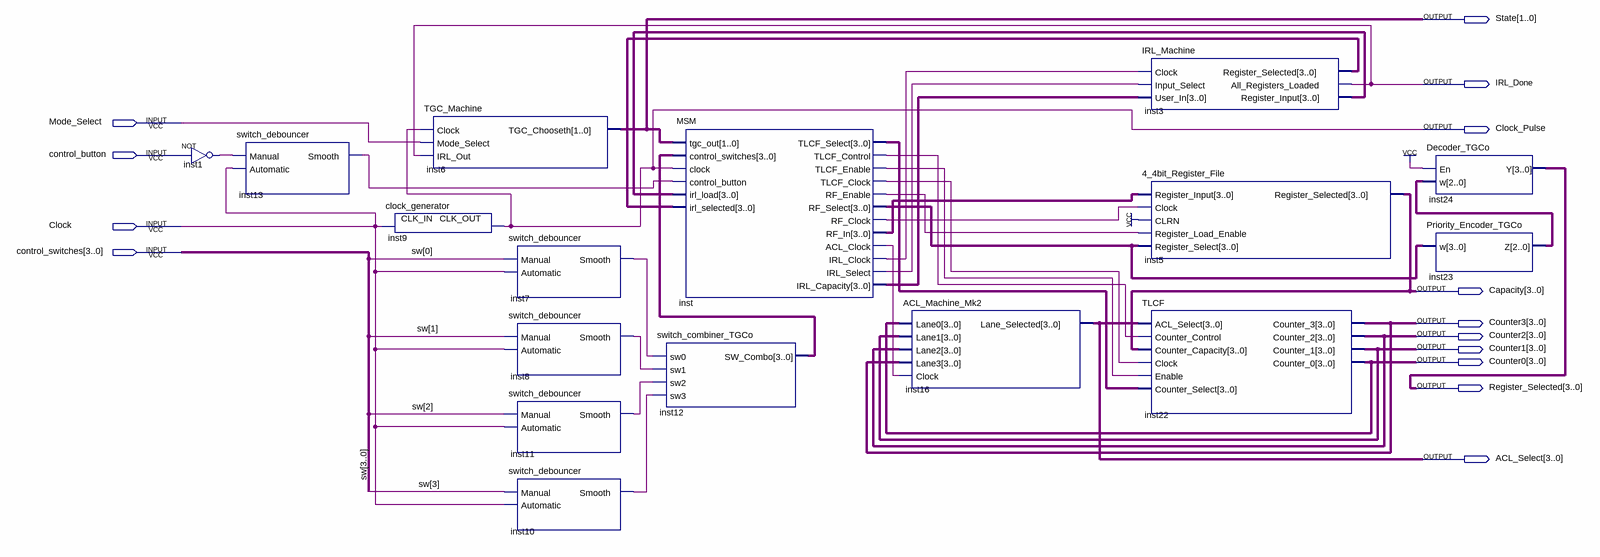
[diagram p0: schematic sheet]
// Quartus schematic TGCo.bdf as structural Verilog: 16 symbols, 14 pins
module TGCo (
  input  Mode_Select,
  input  control_button,
  input  Clock,
  input  [3:0] control_switches,
  output [1:0] State,
  output IRL_Done,
  output Clock_Pulse,
  output [3:0] Capacity,
  output [3:0] Counter3,
  output [3:0] Counter2,
  output [3:0] Counter1,
  output [3:0] Counter0,
  output [3:0] Register_Selected,
  output [3:0] ACL_Select
);

  wire inst1_out, inst7_smooth, inst8_smooth, inst10_smooth, inst11_smooth, inst13_smooth, inst_acl_clock,
       inst_irl_clock, inst_irl_select, inst_rf_clock, inst_rf_enable, inst_tlcf_clock, inst_tlcf_control,
       inst_tlcf_enable;
  wire [2:0] inst23_z;
  wire [3:0] inst3_register_input, inst3_register_selected, inst12_sw_combo, inst_irl_capacity, inst_rf_in,
       inst_rf_select, inst_tlcf_select;

  not inst1 (inst1_out, control_button);
  switch_debouncer inst13 (.Manual(inst1_out), .Automatic(Clock), .Smooth(inst13_smooth));
  TGC_Machine inst6 (.Clock(Clock_Pulse), .Mode_Select(Mode_Select), .IRL_Out(IRL_Done), .TGC_Chooseth(State));
  clock_generator inst9 (.CLK_IN(Clock), .CLK_OUT(Clock_Pulse));
  switch_debouncer inst7 (.Manual(control_switches[0]), .Automatic(Clock), .Smooth(inst7_smooth));
  switch_debouncer inst8 (.Manual(control_switches[1]), .Automatic(Clock), .Smooth(inst8_smooth));
  switch_debouncer inst11 (.Manual(control_switches[2]), .Automatic(Clock), .Smooth(inst11_smooth));
  switch_debouncer inst10 (.Manual(control_switches[3]), .Automatic(Clock), .Smooth(inst10_smooth));
  MSM inst (
    .tgc_out(State), .control_switches(inst12_sw_combo), .clock(Clock_Pulse), .control_button(inst13_smooth),
    .irl_load(inst3_register_input), .irl_selected(inst3_register_selected), .TLCF_Select(inst_tlcf_select),
    .TLCF_Control(inst_tlcf_control), .TLCF_Enable(inst_tlcf_enable), .TLCF_Clock(inst_tlcf_clock),
    .RF_Enable(inst_rf_enable), .RF_Select(inst_rf_select), .RF_Clock(inst_rf_clock), .RF_In(inst_rf_in),
    .ACL_Clock(inst_acl_clock), .IRL_Clock(inst_irl_clock), .IRL_Select(inst_irl_select),
    .IRL_Capacity(inst_irl_capacity));
  switch_combiner_TGCo inst12 (
    .sw0(inst7_smooth), .sw1(inst8_smooth), .sw2(inst11_smooth), .sw3(inst10_smooth),
    .SW_Combo(inst12_sw_combo));
  ACL_Machine_Mk2 inst16 (
    .Lane0(Counter0), .Lane1(Counter1), .Lane2(Counter2), .Lane3(Counter3), .Clock(inst_acl_clock),
    .Lane_Selected(ACL_Select));
  IRL_Machine inst3 (
    .Clock(inst_irl_clock), .Input_Select(inst_irl_select), .User_In(inst_irl_capacity),
    .Register_Selected(inst3_register_selected), .All_Registers_Loaded(IRL_Done),
    .Register_Input(inst3_register_input));
  \4_4bit_Register_File  inst5 (
    .Register_Input(inst_rf_in), .Clock(inst_rf_clock), .CLRN(1'b1), .Register_Load_Enable(inst_rf_enable),
    .Register_Select(inst_rf_select), .Register_Selected(Capacity));
  TLCF inst22 (
    .ACL_Select(ACL_Select), .Counter_Control(inst_tlcf_control), .Counter_Capacity(Capacity),
    .Clock(inst_tlcf_clock), .Enable(inst_tlcf_enable), .Counter_Select(inst_tlcf_select),
    .Counter_3(Counter3), .Counter_2(Counter2), .Counter_1(Counter1), .Counter_0(Counter0));
  Decoder_TGCo inst24 (.En(1'b1), .w(inst23_z), .Y(Register_Selected));
  Priority_Encoder_TGCo inst23 (.w(inst_rf_select), .Z(inst23_z));

  // Other names for the same wires on the sheet: sw[3:0] = control_switches
endmodule
